# Altium project Dragonflyte.PrjPcb (part 1 of 2)
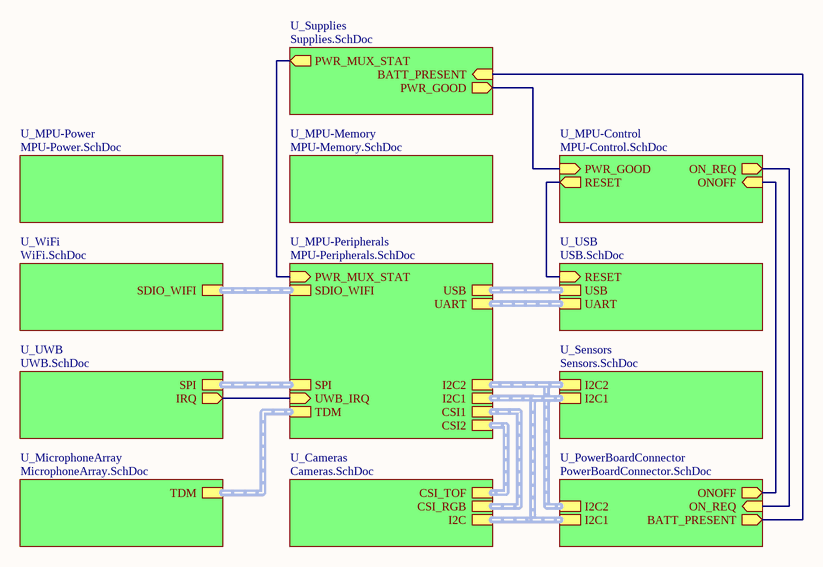
[diagram p0: Dragonflyte.SchDoc]
12 sheets, 197 parts. Net scope: hierarchical (ports join the sheet entries above them; power ports are global).
Board file: Dragonflyte.PcbDoc
Sheets:
  Dragonflyte.SchDoc
    U_Supplies = Supplies.SchDoc
    U_MPU-Power = MPU-Power.SchDoc
    U_MPU-Control = MPU-Control.SchDoc
    U_MPU-Peripherals = MPU-Peripherals.SchDoc
    U_WiFi = WiFi.SchDoc
    U_USB = USB.SchDoc
    U_Sensors = Sensors.SchDoc
    U_UWB = UWB.SchDoc
    U_MicrophoneArray = MicrophoneArray.SchDoc
    U_Cameras = Cameras.SchDoc
    U_PowerBoardConnector = PowerBoardConnector.SchDoc

## Sheet Dragonflyte.SchDoc
size A; DocumentNumber: 1; SheetNumber: 1

### Sub-sheets
U_Cameras = Cameras.SchDoc: CSI_TOF (harness CSI12), I2C (harness I2C), CSI_RGB (harness CSI8)
U_MicrophoneArray = MicrophoneArray.SchDoc: TDM (harness TDM)
U_MPU-Control = MPU-Control.SchDoc: PWR_GOOD (in), RESET (out), ON_REQ (out), ONOFF (in)
U_MPU-Memory = MPU-Memory.SchDoc (file not in this document): no entries
U_MPU-Peripherals = MPU-Peripherals.SchDoc: SDIO_WIFI (harness SDIO), UART (harness UART), USB (harness USB), TDM (harness TDM), SPI (harness SPI), CSI1 (harness CSI8), I2C2 (harness I2C), I2C1 (harness I2C), CSI2 (harness CSI12), UWB_IRQ (in), PWR_MUX_STAT (in)
U_MPU-Power = MPU-Power.SchDoc: no entries
U_PowerBoardConnector = PowerBoardConnector.SchDoc: ONOFF (out), ON_REQ (in), I2C1 (harness I2C), I2C2 (harness I2C), BATT_PRESENT (out)
U_Sensors = Sensors.SchDoc: I2C1 (harness I2C), I2C2 (harness I2C)
U_Supplies = Supplies.SchDoc: PWR_GOOD (out), PWR_MUX_STAT (out), BATT_PRESENT (in)
U_USB = USB.SchDoc: RESET (in), USB (harness USB), UART (harness UART)
U_UWB = UWB.SchDoc: SPI (harness SPI), IRQ (out)
U_WiFi = WiFi.SchDoc: SDIO_WIFI (harness SDIO)

### Nets
PWR_GOOD: sheet U_Supplies/PWR_GOOD, sheet U_MPU-Control/PWR_GOOD
RESET: sheet U_MPU-Control/RESET, sheet U_USB/RESET
NetJP3_5: sheet U_MPU-Control/ON_REQ, sheet U_PowerBoardConnector/ON_REQ
NetJP3_6: sheet U_MPU-Control/ONOFF, sheet U_PowerBoardConnector/ONOFF
NetJP3_32: sheet U_Supplies/BATT_PRESENT, sheet U_PowerBoardConnector/BATT_PRESENT
NetR38_1: sheet U_Supplies/PWR_MUX_STAT, sheet U_MPU-Peripherals/PWR_MUX_STAT
NetU1_A16: sheet U_MPU-Peripherals/UWB_IRQ, sheet U_UWB/IRQ

### Buses and harness runs
harness sheet U_Cameras/CSI_RGB = sheet U_MPU-Peripherals/CSI1
harness sheet U_Cameras/CSI_TOF = sheet U_MPU-Peripherals/CSI2
harness sheet U_Cameras/I2C = sheet U_MPU-Peripherals/I2C1 = sheet U_PowerBoardConnector/I2C1 = sheet U_Sensors/I2C1
harness sheet U_MicrophoneArray/TDM = sheet U_MPU-Peripherals/TDM
harness sheet U_MPU-Peripherals/I2C2 = sheet U_PowerBoardConnector/I2C2 = sheet U_Sensors/I2C2
harness sheet U_MPU-Peripherals/SDIO_WIFI = sheet U_WiFi/SDIO_WIFI
harness sheet U_MPU-Peripherals/SPI = sheet U_UWB/SPI
harness sheet U_MPU-Peripherals/UART = sheet U_USB/UART
harness sheet U_MPU-Peripherals/USB = sheet U_USB/USB

## Sheet Supplies.SchDoc
size A; DocumentNumber: 6; SheetNumber: 6
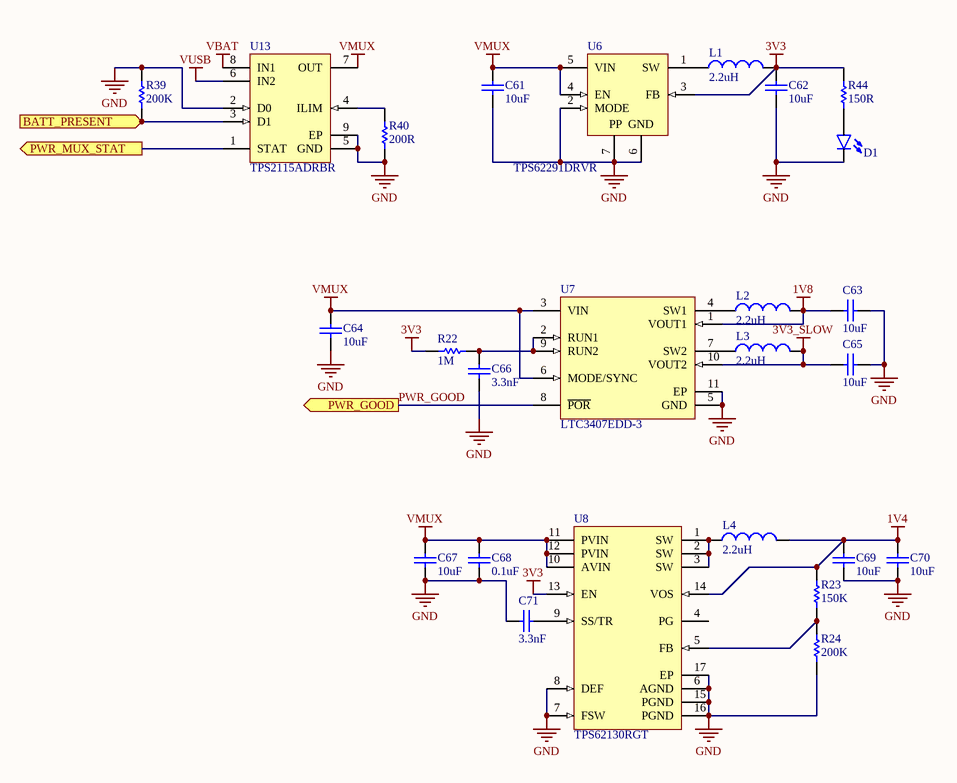
[diagram p1: Supplies.SchDoc]

### Parts
C61  value 10uF  [C0402[1005X55]]  (hidden comment: 10uF 6.3V 0402)
C62  value 10uF  [C0402[1005X55]]  (hidden comment: 10uF 6.3V 0402)
C63  value 10uF  [C0402[1005X55]]  (hidden comment: 10uF 6.3V 0402)
C64  value 10uF  [C0402[1005X55]]  (hidden comment: 10uF 6.3V 0402)
C65  value 10uF  [C0402[1005X55]]  (hidden comment: 10uF 6.3V 0402)
C66  value 3.3nF  [C0402[1005X55]]  (hidden comment: 3.3nF 50V 0402)
C67  value 10uF  [C0402[1005X55]]  (hidden comment: 10uF 6.3V 0402)
C68  value 0.1uF  [C0402[1005X55]]  (hidden comment: 0.1uF 6.3V 0402)
C69  value 10uF  [C0402[1005X55]]  (hidden comment: 10uF 6.3V 0402)
C70  value 10uF  [C0402[1005X55]]  (hidden comment: 10uF 6.3V 0402)
C71  value 3.3nF  [C0402[1005X55]]  (hidden comment: 3.3nF 50V 0402)
D1  LED_0603_BLUE_5mA  [LED0603]  (value not drawn)
L1  2.2uH  [IND0805]
L2  2.2uH  [IND0603]
L3  2.2uH  [IND0603]
L4  2.2uH  [IND1008]
R22  value 1M  [R0402[1005]]  (hidden comment: 1M 1% 0402)
R23  value 150K  [R0402[1005]]  (hidden comment: 150K 1% 0402)
R24  value 200K  [R0402[1005]]  (hidden comment: 200K 1% 0402)
R39  value 200K  [R0402[1005]]  (hidden comment: 200K 1% 0402)
R40  value 200R  [R0402[1005]]  (hidden comment: 200R 1% 0402)
R44  value 150R  [R0402[1005]]  (hidden comment: 150R 1% 0402)
U6  TPS62291DRVR  [WSON-6]
U7  LTC3407EDD-3  [VSON-10 (3mmx3mm)]
U8  TPS62130RGT  [QFN-16]
U13  TPS2115ADRBR  [VSON-8 (3x3MM)]

### Ports
BATT_PRESENT (in), PWR_GOOD (out), PWR_MUX_STAT (out)

### Nets
1V4: C69.2 C70.2 L4.2 R23.2 U8.14(VOS)
1V8: C63.2 L2.2 U7.1(VOUT1)
3V3: C62.2 L1.2 R22.2 R44.2 U6.3(FB) U8.13(EN)
3V3_SLOW: C65.1 L3.2 U7.10(VOUT2)
GND: C61.1 C62.1 C63.1 C64.1 C65.2 C66.1 C67.1 C68.1 C69.1 C70.1 C71.1 D1.C R24.1 R39.2 R40.1 U6.2(MODE) U6.6(GND) U6.7(EP) U7.5(GND) U7.11(EP) U8.6(AGND) U8.7(FSW) U8.8(DEF) U8.15(PGND) U8.16(PGND) U8.17(EP) U13.2(D0) U13.5(GND) U13.9(EP)
VBAT: U13.8(IN1)
VMUX: C61.2 C64.2 C67.2 C68.2 U6.4(EN) U6.5(VIN) U7.3(VIN) U7.6(MODE/SYNC) U8.10(AVIN) U8.11(PVIN) U8.12(PVIN) U13.7(OUT)
VUSB: U13.6(IN2)
PWR_GOOD: U7.8(~{POR}) ; port PWR_GOOD
NetC66_2: C66.2 R22.1 U7.2(RUN1) U7.9(RUN2)
NetC71_2: C71.2 U8.9(SS/TR)
NetD1_A: D1.A R44.1
NetJP3_32: R39.1 U13.3(D1) ; port BATT_PRESENT
NetL1_1: L1.1 U6.1(SW)
NetL2_1: L2.1 U7.4(SW1)
NetL3_1: L3.1 U7.7(SW2)
NetL4_1: L4.1 U8.1(SW) U8.2(SW) U8.3(SW)
NetR23_1: R23.1 R24.2 U8.5(FB)
NetR38_1: U13.1(STAT) ; port PWR_MUX_STAT
NetR40_2: R40.2 U13.4(ILIM)

Not connected (* = marked no-connect by the designer): U8 4(PG)

### Notes on the sheet
- (in symbol TPS62291DRVR) PP

### Library data of the parts
C61-C65 C67 C69 C70 = CAP_10uF_6.3V_0402_20%: 10uF 6.3V 20% 0402 (1005 Metric); PartNumber: GRM155R60J106ME44D; Manufacturer: Murata; Tolerance: 20%; Mounting Technology: Surface Mount; PackageReference: 0402; PackageDescription: 0402 (1005 Metric); Voltage: 6.3V
C66 C71 = CAP_3.3nF_50V_0402_10%: 3.3nF 50V 10% 0402 (1005 Metric); PartNumber: GRM155R71H332KA01D; Manufacturer: Murata; Mounting Technology: Surface Mount; PackageReference: 0402; PackageDescription: 0402 (1005 Metric); Voltage: 50V; Tolerance: 10%
C68 = CAP_0.1uF_6.3V_0402_10%: 0.1uF 6.3V 10% 0402 (1005 Metric); PartNumber: GRM155R70J104KA01D; Manufacturer: Murata; Mounting Technology: Surface Mount; PackageReference: 0402; PackageDescription: 0402 (1005 Metric); Voltage: 6.3V; Tolerance: 10%
D1 = LED_0603_BLUE_5mA: PartNumber: LTST-C193TBKT-5A; Manufacturer: Lite-On Inc.; PackageReference: 0603; PackageDescription: 0603 (1608 Metric); Mounting Technology: Surface Mount
L1 = IND_2.2uH_1.7A_0805_20%: 2.2uH 20% 1.7A 0805; PartNumber: LQM21PN2R2MGHL; Manufacturer: Murata; PackageReference: 0805; PackageDescription: 0805 (2012 metric); Value: 2.2uH; Mounting Technology: Surface Mount; Current: 1.7A
L2 L3 = IND_2.2uH_750mA_0603_20%: 2.2uH 20% 750mA 0603; PartNumber: LQM18PZ2R2MCHD; Manufacturer: Murata; PackageReference: 0603; PackageDescription: 0603 (1608 metric); Value: 2.2uH; Mounting Technology: Surface Mount; Current: 750mA
L4 = IND_2.2uH_3.3A_1008_20%: 2.2uH 20% 3.3A 1008; PartNumber: DFE252012F-2R2M=P2; Manufacturer: Murata; PackageReference: 1008; PackageDescription: 1008 (2520 metric); Mounting Technology: Surface Mount; Current: 3.3A; Value: 2.2uH
R22 = RES_1M_0402_1%: 1M 0.063W 1% 0402 (1005 Metric); Manufacturer: KOA Speer; PartNumber: RK73H1ETTP1004F; Tolerance: 1%; Power: 0.063W; Mounting Technology: Surface Mount; PackageReference: 0402; PackageDescription: 0402 (1005 Metric); ComponentLink1Description: Datasheet; ComponentLink1URL: http://www.koaspeer.com/catimages/Products/RK73H/RK73H.pdf
R23 = RES_150K_0402_1%: 150K 0.063W 1% 0402 (1005 Metric); Manufacturer: KOA Speer; PartNumber: RK73H1ETTP1503F; Tolerance: 1%; Power: 0.063W; Mounting Technology: Surface Mount; PackageReference: 0402; PackageDescription: 0402 (1005 Metric); ComponentLink1Description: Datasheet; ComponentLink1URL: http://www.koaspeer.com/catimages/Products/RK73H/RK73H.pdf
R24 R39 = RES_200K_0402_1%: 200K 0.063W 1% 0402 (1005 Metric); Manufacturer: KOA Speer; PartNumber: RK73H1ETTP2003F; Tolerance: 1%; Power: 0.063W; Mounting Technology: Surface Mount; PackageReference: 0402; PackageDescription: 0402 (1005 Metric); ComponentLink1Description: Datasheet; ComponentLink1URL: http://www.koaspeer.com/catimages/Products/RK73H/RK73H.pdf
R40 = RES_200R_0402_1%: 200R 0.063W 1% 0402 (1005 Metric); Manufacturer: KOA Speer; PartNumber: RK73H1ETTP2000F; Tolerance: 1%; Power: 0.063W; Mounting Technology: Surface Mount; PackageReference: 0402; PackageDescription: 0402 (1005 Metric); ComponentLink1Description: Datasheet; ComponentLink1URL: http://www.koaspeer.com/catimages/Products/RK73H/RK73H.pdf
R44 = RES_150R_0402_1%: 150R 0.063W 1% 0402 (1005 Metric); Manufacturer: KOA Speer; PartNumber: RK73H1ETTP1500F; Tolerance: 1%; Power: 0.063W; Mounting Technology: Surface Mount; PackageReference: 0402; PackageDescription: 0402 (1005 Metric); ComponentLink1Description: Datasheet; ComponentLink1URL: http://www.koaspeer.com/catimages/Products/RK73H/RK73H.pdf
U6 = TPS62291DRVR: Voltage Regulators - Switching Regulators 2.25MHz 1A Step-Down Cnvrtr 3.3V Output; Manufacturer: Texas Instruments; PartNumber: TPS62291DRVR; PackageReference: WSON-6; PackageDescription: SON, 6-Leads, Body 2x2mm, Pitch 0.65mm, Thermal Pad 1.6x1mm, TI Recommended; Mounting Technology: Surface Mount
U7 = LTC3407EDD-3: Manufacturer: Linear Technology; PartNumber: LTC3407EDD-3; PackageReference: SON-10; Mounting Technology: Surface Mount
U8 = TPS62130RGT: Manufacturer: Texas Instruments; PartNumber: TPS62130RGT; PackageReference: QFN-16; Mounting Technology: Surface Mount
U13 = TPS2115ADRBR: Power Switch ICs - Power Distribution Autoswitching Pwr Mux; Manufacturer: Texas Instruments; PartNumber: TPS2115ADRBR; PackageReference: VSON-8; Mounting Technology: Surface Mount

## Sheet MPU-Power.SchDoc
size B; DocumentNumber: 2; SheetNumber: 2
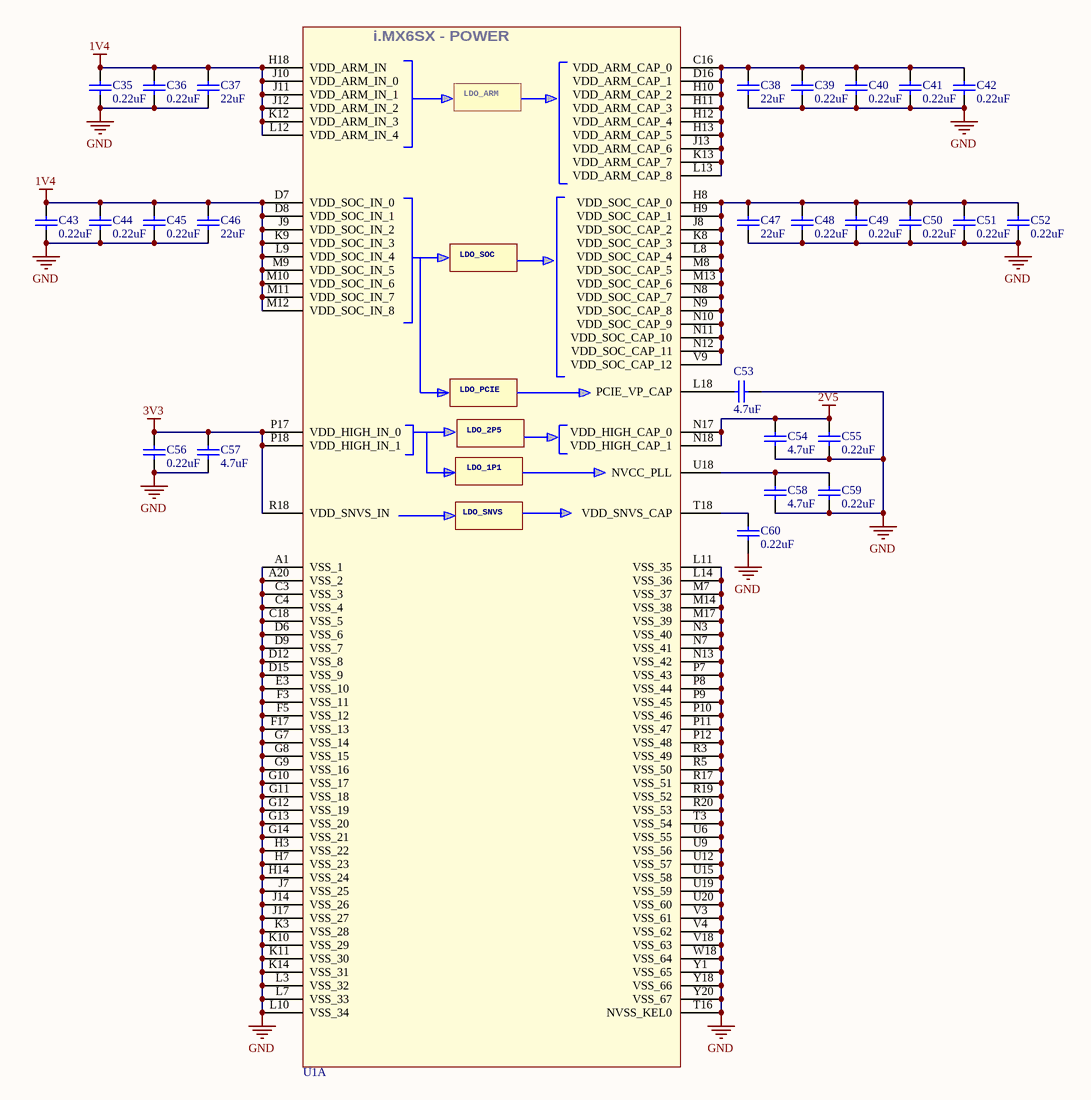
[diagram p2: MPU-Power.SchDoc]

### Parts
C35  value 0.22uF  [C0402[1005X55]]  (hidden comment: 0.22uF 6.3V 0402)
C36  value 0.22uF  [C0402[1005X55]]  (hidden comment: 0.22uF 6.3V 0402)
C37  value 22uF  [C0603[1608X92]]  (hidden comment: 22uF 6.3V 0603)
C38  value 22uF  [C0603[1608X92]]  (hidden comment: 22uF 6.3V 0603)
C39  value 0.22uF  [C0402[1005X55]]  (hidden comment: 0.22uF 6.3V 0402)
C40  value 0.22uF  [C0402[1005X55]]  (hidden comment: 0.22uF 6.3V 0402)
C41  value 0.22uF  [C0402[1005X55]]  (hidden comment: 0.22uF 6.3V 0402)
C42  value 0.22uF  [C0402[1005X55]]  (hidden comment: 0.22uF 6.3V 0402)
C43  value 0.22uF  [C0402[1005X55]]  (hidden comment: 0.22uF 6.3V 0402)
C44  value 0.22uF  [C0402[1005X55]]  (hidden comment: 0.22uF 6.3V 0402)
C45  value 0.22uF  [C0402[1005X55]]  (hidden comment: 0.22uF 6.3V 0402)
C46  value 22uF  [C0603[1608X92]]  (hidden comment: 22uF 6.3V 0603)
C47  value 22uF  [C0603[1608X92]]  (hidden comment: 22uF 6.3V 0603)
C48  value 0.22uF  [C0402[1005X55]]  (hidden comment: 0.22uF 6.3V 0402)
C49  value 0.22uF  [C0402[1005X55]]  (hidden comment: 0.22uF 6.3V 0402)
C50  value 0.22uF  [C0402[1005X55]]  (hidden comment: 0.22uF 6.3V 0402)
C51  value 0.22uF  [C0402[1005X55]]  (hidden comment: 0.22uF 6.3V 0402)
C52  value 0.22uF  [C0402[1005X55]]  (hidden comment: 0.22uF 6.3V 0402)
C53  value 4.7uF  [C0402[1005X55]]  (hidden comment: 4.7uF 6.3V 0402)
C54  value 4.7uF  [C0402[1005X55]]  (hidden comment: 4.7uF 6.3V 0402)
C55  value 0.22uF  [C0402[1005X55]]  (hidden comment: 0.22uF 6.3V 0402)
C56  value 0.22uF  [C0402[1005X55]]  (hidden comment: 0.22uF 6.3V 0402)
C57  value 4.7uF  [C0402[1005X55]]  (hidden comment: 4.7uF 6.3V 0402)
C58  value 4.7uF  [C0402[1005X55]]  (hidden comment: 4.7uF 6.3V 0402)
C59  value 0.22uF  [C0402[1005X55]]  (hidden comment: 0.22uF 6.3V 0402)
C60  value 0.22uF  [C0402[1005X55]]  (hidden comment: 0.22uF 6.3V 0402)
U1  MCIMX6X3EVO10AB  [BGA-400]  (value not drawn)  (part A of 12)

### Nets
1V4: C35.2 C36.2 C37.2 C43.2 C44.2 C45.2 C46.2 U1.D7(VDD_SOC_IN_0) U1.D8(VDD_SOC_IN_1) U1.H18(VDD_ARM_IN) U1.J9(VDD_SOC_IN_2) U1.J10(VDD_ARM_IN_0) U1.J11(VDD_ARM_IN_1) U1.J12(VDD_ARM_IN_2) U1.K9(VDD_SOC_IN_3) U1.K12(VDD_ARM_IN_3) U1.L9(VDD_SOC_IN_4) U1.L12(VDD_ARM_IN_4) U1.M9(VDD_SOC_IN_5) U1.M10(VDD_SOC_IN_6) U1.M11(VDD_SOC_IN_7) U1.M12(VDD_SOC_IN_8)
2V5: C54.2 C55.2 U1.N17(VDD_HIGH_CAP_0) U1.N18(VDD_HIGH_CAP_1)
3V3: C56.2 C57.2 U1.P17(VDD_HIGH_IN_0) U1.P18(VDD_HIGH_IN_1) U1.R18(VDD_SNVS_IN)
GND: C35.1 C36.1 C37.1 C38.1 C39.1 C40.1 C41.1 C42.1 C43.1 C44.1 C45.1 C46.1 C47.1 C48.1 C49.1 C50.1 C51.1 C52.1 C53.1 C54.1 C55.1 C56.1 C57.1 C58.1 C59.1 C60.1 U1.A1(VSS_1) U1.A20(VSS_2) U1.C3(VSS_3) U1.C4(VSS_4) U1.C18(VSS_5) U1.D6(VSS_6) U1.D9(VSS_7) U1.D12(VSS_8) U1.D15(VSS_9) U1.E3(VSS_10) U1.F3(VSS_11) U1.F5(VSS_12) U1.F17(VSS_13) U1.G7(VSS_14) U1.G8(VSS_15) U1.G9(VSS_16) U1.G10(VSS_17) U1.G11(VSS_18) U1.G12(VSS_19) U1.G13(VSS_20) U1.G14(VSS_21) U1.H3(VSS_22) U1.H7(VSS_23) U1.H14(VSS_24) U1.J7(VSS_25) U1.J14(VSS_26) U1.J17(VSS_27) U1.K3(VSS_28) U1.K10(VSS_29) U1.K11(VSS_30) U1.K14(VSS_31) U1.L3(VSS_32) U1.L7(VSS_33) U1.L10(VSS_34) U1.L11(VSS_35) U1.L14(VSS_36) U1.M7(VSS_37) U1.M14(VSS_38) U1.M17(VSS_39) U1.N3(VSS_40) U1.N7(VSS_41) U1.N13(VSS_42) U1.P7(VSS_43) U1.P8(VSS_44) U1.P9(VSS_45) U1.P10(VSS_46) U1.P11(VSS_47) U1.P12(VSS_48) U1.R3(VSS_49) U1.R5(VSS_50) U1.R17(VSS_51) U1.R19(VSS_52) U1.R20(VSS_53) U1.T3(VSS_54) U1.T16(NVSS_KEL0) U1.U6(VSS_55) U1.U9(VSS_56) U1.U12(VSS_57) U1.U15(VSS_58) U1.U19(VSS_59) U1.U20(VSS_60) U1.V3(VSS_61) U1.V4(VSS_62) U1.V18(VSS_63) U1.W18(VSS_64) U1.Y1(VSS_65) U1.Y18(VSS_66) U1.Y20(VSS_67)
NetC38_2: C38.2 C39.2 C40.2 C41.2 C42.2 U1.C16(VDD_ARM_CAP_0) U1.D16(VDD_ARM_CAP_1) U1.H10(VDD_ARM_CAP_2) U1.H11(VDD_ARM_CAP_3) U1.H12(VDD_ARM_CAP_4) U1.H13(VDD_ARM_CAP_5) U1.J13(VDD_ARM_CAP_6) U1.K13(VDD_ARM_CAP_7) U1.L13(VDD_ARM_CAP_8)
NetC47_2: C47.2 C48.2 C49.2 C50.2 C51.2 C52.2 U1.H8(VDD_SOC_CAP_0) U1.H9(VDD_SOC_CAP_1) U1.J8(VDD_SOC_CAP_2) U1.K8(VDD_SOC_CAP_3) U1.L8(VDD_SOC_CAP_4) U1.M8(VDD_SOC_CAP_5) U1.M13(VDD_SOC_CAP_6) U1.N8(VDD_SOC_CAP_7) U1.N9(VDD_SOC_CAP_8) U1.N10(VDD_SOC_CAP_9) U1.N11(VDD_SOC_CAP_10) U1.N12(VDD_SOC_CAP_11) U1.V9(VDD_SOC_CAP_12)
NetC53_2: C53.2 U1.L18(PCIE_VP_CAP)
NetC58_2: C58.2 C59.2 U1.U18(NVCC_PLL)
NetC60_2: C60.2 U1.T18(VDD_SNVS_CAP)

### Notes on the sheet
- (in symbol MCIMX6X3EVO10AB, part A) i.MX6SX - POWER; LDO_ARM; LDO_SOC; LDO_PCIE; LDO_2P5; LDO_1P1; LDO_SNVS

### Library data of the parts
C35 C36 C39-C45 C48-C52 C55 C56 C59 C60 = CAP_0.22uF_6.3V_0402_10%: 0.22uF 6.3V 10% 0402 (1005 Metric); PartNumber: JMK105BJ224KV-F; Manufacturer: Taiyo Yuden; Mounting Technology: Surface Mount; PackageReference: 0402; PackageDescription: 0402 (1005 Metric); Voltage: 6.3V; Tolerance: 10%
C37 C38 C46 C47 = CAP_22uF_6.3V_0603_10%: 22uF 6.3V 10% 0603 (1608 Metric); PartNumber: GRT188R60J226ME13D; Manufacturer: Murata; Mounting Technology: Surface Mount; PackageReference: 0603; PackageDescription: 0603 (1608 Metric); Voltage: 6.3V; Tolerance: 10%
C53 C54 C57 C58 = CAP_4.7uF_6.3V_0402_20%: 4.7uF 6.3V 20% 0402 (1005 Metric); PartNumber: GRM155R60J475ME47D; Manufacturer: Murata; Mounting Technology: Surface Mount; PackageReference: 0402; PackageDescription: 0402 (1005 Metric); Voltage: 6.3V; Tolerance: 20%
U1 = MCIMX6X3EVO10AB: IC MPU I.MX6SX 1GHZ 400MAPBGA; Manufacturer: NXP; PartNumber: MCIMX6X3EVO10AB; Mounting Technology: Surface Mount; PackageReference: BGA-400

## Sheet MPU-Control.SchDoc
size A
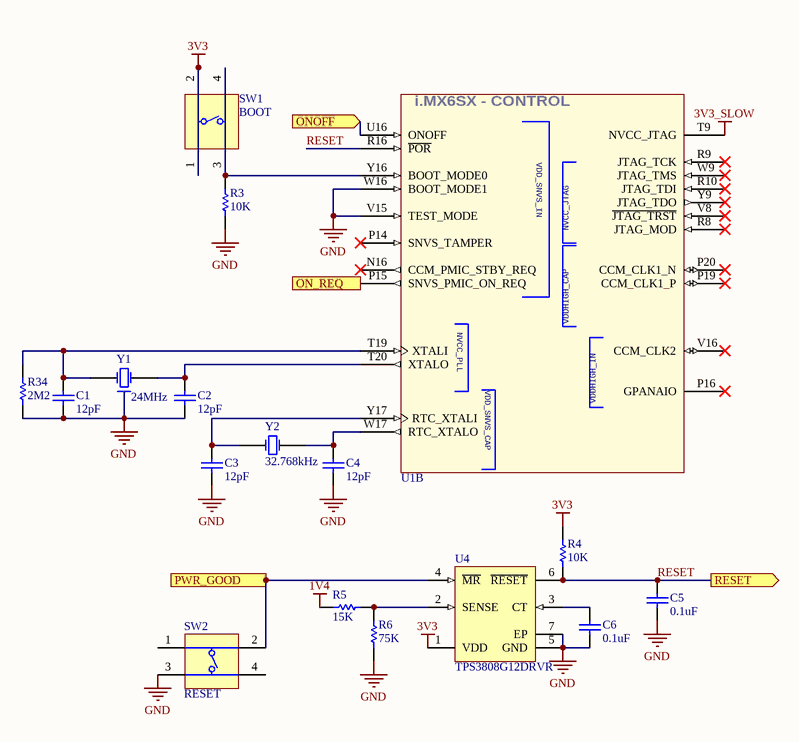
[diagram p3: MPU-Control.SchDoc]

### Parts
C1  value 12pF  [C0402[1005X55]]  (hidden comment: 12pF 50V 0402)
C2  value 12pF  [C0402[1005X55]]  (hidden comment: 12pF 50V 0402)
C3  value 12pF  [C0402[1005X55]]  (hidden comment: 12pF 50V 0402)
C4  value 12pF  [C0402[1005X55]]  (hidden comment: 12pF 50V 0402)
C5  value 0.1uF  [C0402[1005X55]]  (hidden comment: 0.1uF 6.3V 0402)
C6  value 0.1uF  [C0402[1005X55]]  (hidden comment: 0.1uF 100V 0402)
R3  value 10K  [R0402[1005]]  (hidden comment: 10K 1% 0402)
R4  value 10K  [R0402[1005]]  (hidden comment: 10K 1% 0402)
R5  value 15K  [R0402[1005]]  (hidden comment: 15K 1% 0402)
R6  value 75K  [R0402[1005]]  (hidden comment: 75K 1% 0402)
R34  value 2M2  [R0402[1005]]  (hidden comment: 2M2 1% 0402)
SW1  BOOT  [SWITCH]
SW2  RESET  [SWITCH]
U1  MCIMX6X3EVO10AB  [BGA-400]  (value not drawn)  (part B of 12)
U4  TPS3808G12DRVR  [WSON-6]
Y1  24MHz  [CRYSTAL_2.0x1.6]
Y2  32.768kHz  [CRYSTAL_2.0x1.2]

### Ports
ON_REQ (out), ONOFF (in), PWR_GOOD (in), RESET (out)

### Nets
1V4: R5.2
3V3: R4.2 SW1.1(T1) SW1.2(T2) U4.1(VDD)
3V3_SLOW: U1.T9(NVCC_JTAG)
GND: C1.1 C2.1 C3.1 C4.1 C5.1 C6.1 R3.1 R6.1 R34.1 SW2.3(T3) U1.V15(TEST_MODE) U1.W16(BOOT_MODE1) U4.5(GND) U4.7(EP) Y1.2
PWR_GOOD: SW2.2(T2) U4.4(~{MR}) ; port PWR_GOOD
RESET: C5.2 R4.1 U1.R16(~{POR}) U4.6(~{RESET}) ; port RESET
NetC1_2: C1.2 R34.2 U1.T19(XTALI) Y1.1(X1)
NetC2_2: C2.2 U1.T20(XTALO) Y1.3(X2)
NetC3_2: C3.2 U1.Y17(RTC_XTALI) Y2.1(X1)
NetC4_2: C4.2 U1.W17(RTC_XTALO) Y2.2(X2)
NetC6_2: C6.2 U4.3(CT)
NetJP3_5: U1.P15(SNVS_PMIC_ON_REQ) ; port ON_REQ
NetJP3_6: U1.U16(ONOFF) ; port ONOFF
NetR3_2: R3.2 SW1.3(T3) SW1.4(T3) U1.Y16(BOOT_MODE0)
NetR5_1: R5.1 R6.2 U4.2(SENSE)

Not connected (* = marked no-connect by the designer): SW2 1(T1) 4(T3); U1 N16(CCM_PMIC_STBY_REQ)* P14(SNVS_TAMPER)* P16(GPANAIO)* P19(CCM_CLK1_P)* P20(CCM_CLK1_N)* R8(JTAG_MOD)* R9(JTAG_TCK)* R10(JTAG_TDI)* V8(~{JTAG_TRST})* V16(CCM_CLK2)* W9(JTAG_TMS)* Y9(JTAG_TDO)*

### Notes on the sheet
- (in symbol MCIMX6X3EVO10AB, part B) i.MX6SX - CONTROL; VDDHIGH_CAP; VDDHIGH_IN
- (in symbol MCIMX6X3EVO10AB, part D) i.MX6SX - LCD1; NVCC_LCD1

### Library data of the parts
C1-C4 = CAP_12pF_50V_0402_5%: 12pF 50V 5% 0402 (1005 Metric); PartNumber: GRM1555C1H120JA01D; Manufacturer: Murata; Mounting Technology: Surface Mount; PackageReference: 0402; PackageDescription: 0402 (1005 Metric); Voltage: 50V; Tolerance: 5%
C5 = CAP_0.1uF_6.3V_0402_10%: as C68 on sheet Supplies; Mounting Technology: Surface Mount; PackageReference: 0402; PackageDescription: 0402 (1005 Metric); Voltage: 6.3V; Tolerance: 10%
C6 = CAP_0.1uF_100V_0402_10%: 0.1uF 100V 10% 0402 (1005 Metric); PartNumber: GRM155R62A104KE14D; Manufacturer: Murata; Mounting Technology: Surface Mount; PackageReference: 0402; PackageDescription: 0402 (1005 Metric); Voltage: 100V; Tolerance: 10%
R3 R4 = RES_10K_0402_1%: 10K 0.063W 1% 0402 (1005 Metric); Manufacturer: KOA Speer; PartNumber: RK73H1ETTP1002F; Tolerance: 1%; Power: 0.063W; Mounting Technology: Surface Mount; PackageReference: 0402; PackageDescription: 0402 (1005 Metric); ComponentLink1Description: Datasheet; ComponentLink1URL: http://www.koaspeer.com/catimages/Products/RK73H/RK73H.pdf
R5 = RES_15K_0402_1%: 15K 0.063W 1% 0402 (1005 Metric); Manufacturer: KOA Speer; PartNumber: RK73H1ETTP1502F; Tolerance: 1%; Power: 0.063W; Mounting Technology: Surface Mount; PackageReference: 0402; PackageDescription: 0402 (1005 Metric); ComponentLink1Description: Datasheet; ComponentLink1URL: http://www.koaspeer.com/catimages/Products/RK73H/RK73H.pdf
R6 = RES_75K_0402_1%: 75K 0.063W 1% 0402 (1005 Metric); Manufacturer: KOA Speer; PartNumber: RK73H1ETTP7502F; Tolerance: 1%; Power: 0.063W; Mounting Technology: Surface Mount; PackageReference: 0402; PackageDescription: 0402 (1005 Metric); ComponentLink1Description: Datasheet; ComponentLink1URL: http://www.koaspeer.com/catimages/Products/RK73H/RK73H.pdf
R34 = RES_2M2_0402_1%: 2M2 0.063W 1% 0402 (1005 Metric); Manufacturer: KOA Speer; PartNumber: RK73H1ETTP2204F; Tolerance: 1%; Power: 0.063W; Mounting Technology: Surface Mount; PackageReference: 0402; PackageDescription: 0402 (1005 Metric); ComponentLink1Description: Datasheet; ComponentLink1URL: http://www.koaspeer.com/catimages/Products/RK73H/RK73H.pdf
SW1 SW2 = DIPT-DTSM-6: Switch, SPNO Push Button SMD; Manufacturer: C&K Components; PartNumber: PTS810 SJM 250 SMTR LFS; Packing Type: Tape&Reel; Mechanical Life: 200,000 cycles; ComponentLink2URL: http://www.dip.com.tw/Products_tact.htm; ComponentLink1URL: http://www.dip.com.tw/; ComponentLink3URL: http://www.dip.com.tw/PDF/pro_tact/DTSM_G_-6_2_-V.pdf; PackageDescription: Switch, Surface Mount, 4 Leads, Body 4.6x2.8mm, Height 1.9mm; ComponentLink2Description: Datasheet; ComponentLink3Description: Package Specification; ComponentLink1Description: Manufacturer URL; PackageReference: PTS810; Mounting Technology: Surface Mount
U1 = MCIMX6X3EVO10AB: as U1 on sheet MPU-Power; PartNumber: MCIMX6X3EVO10AB; Mounting Technology: Surface Mount; PackageReference: BGA-400
U4 = TPS3808G12DRVR: Manufacturer: Texas Instruments; PackageReference: WSON-6; Mounting Technology: Surface Mount; PartNumber: TPS3808G12DRVR
Y1 = FA-128 24.0000MF10Z-W3: Manufacturer: EPSON; PartNumber: FA-128 24.0000MF10Z-W3; Mounting Technology: Surface Mount; PackageReference: 4-SMD
Y2 = ABS06-32.768KHZ-9-1-T: Manufacturer: Abracon; PartNumber: ABS06-32.768KHZ-9-1-T; Mounting Technology: Surface Mount; PackageReference: 4-SMD

## Sheet MPU-Peripherals.SchDoc
size C
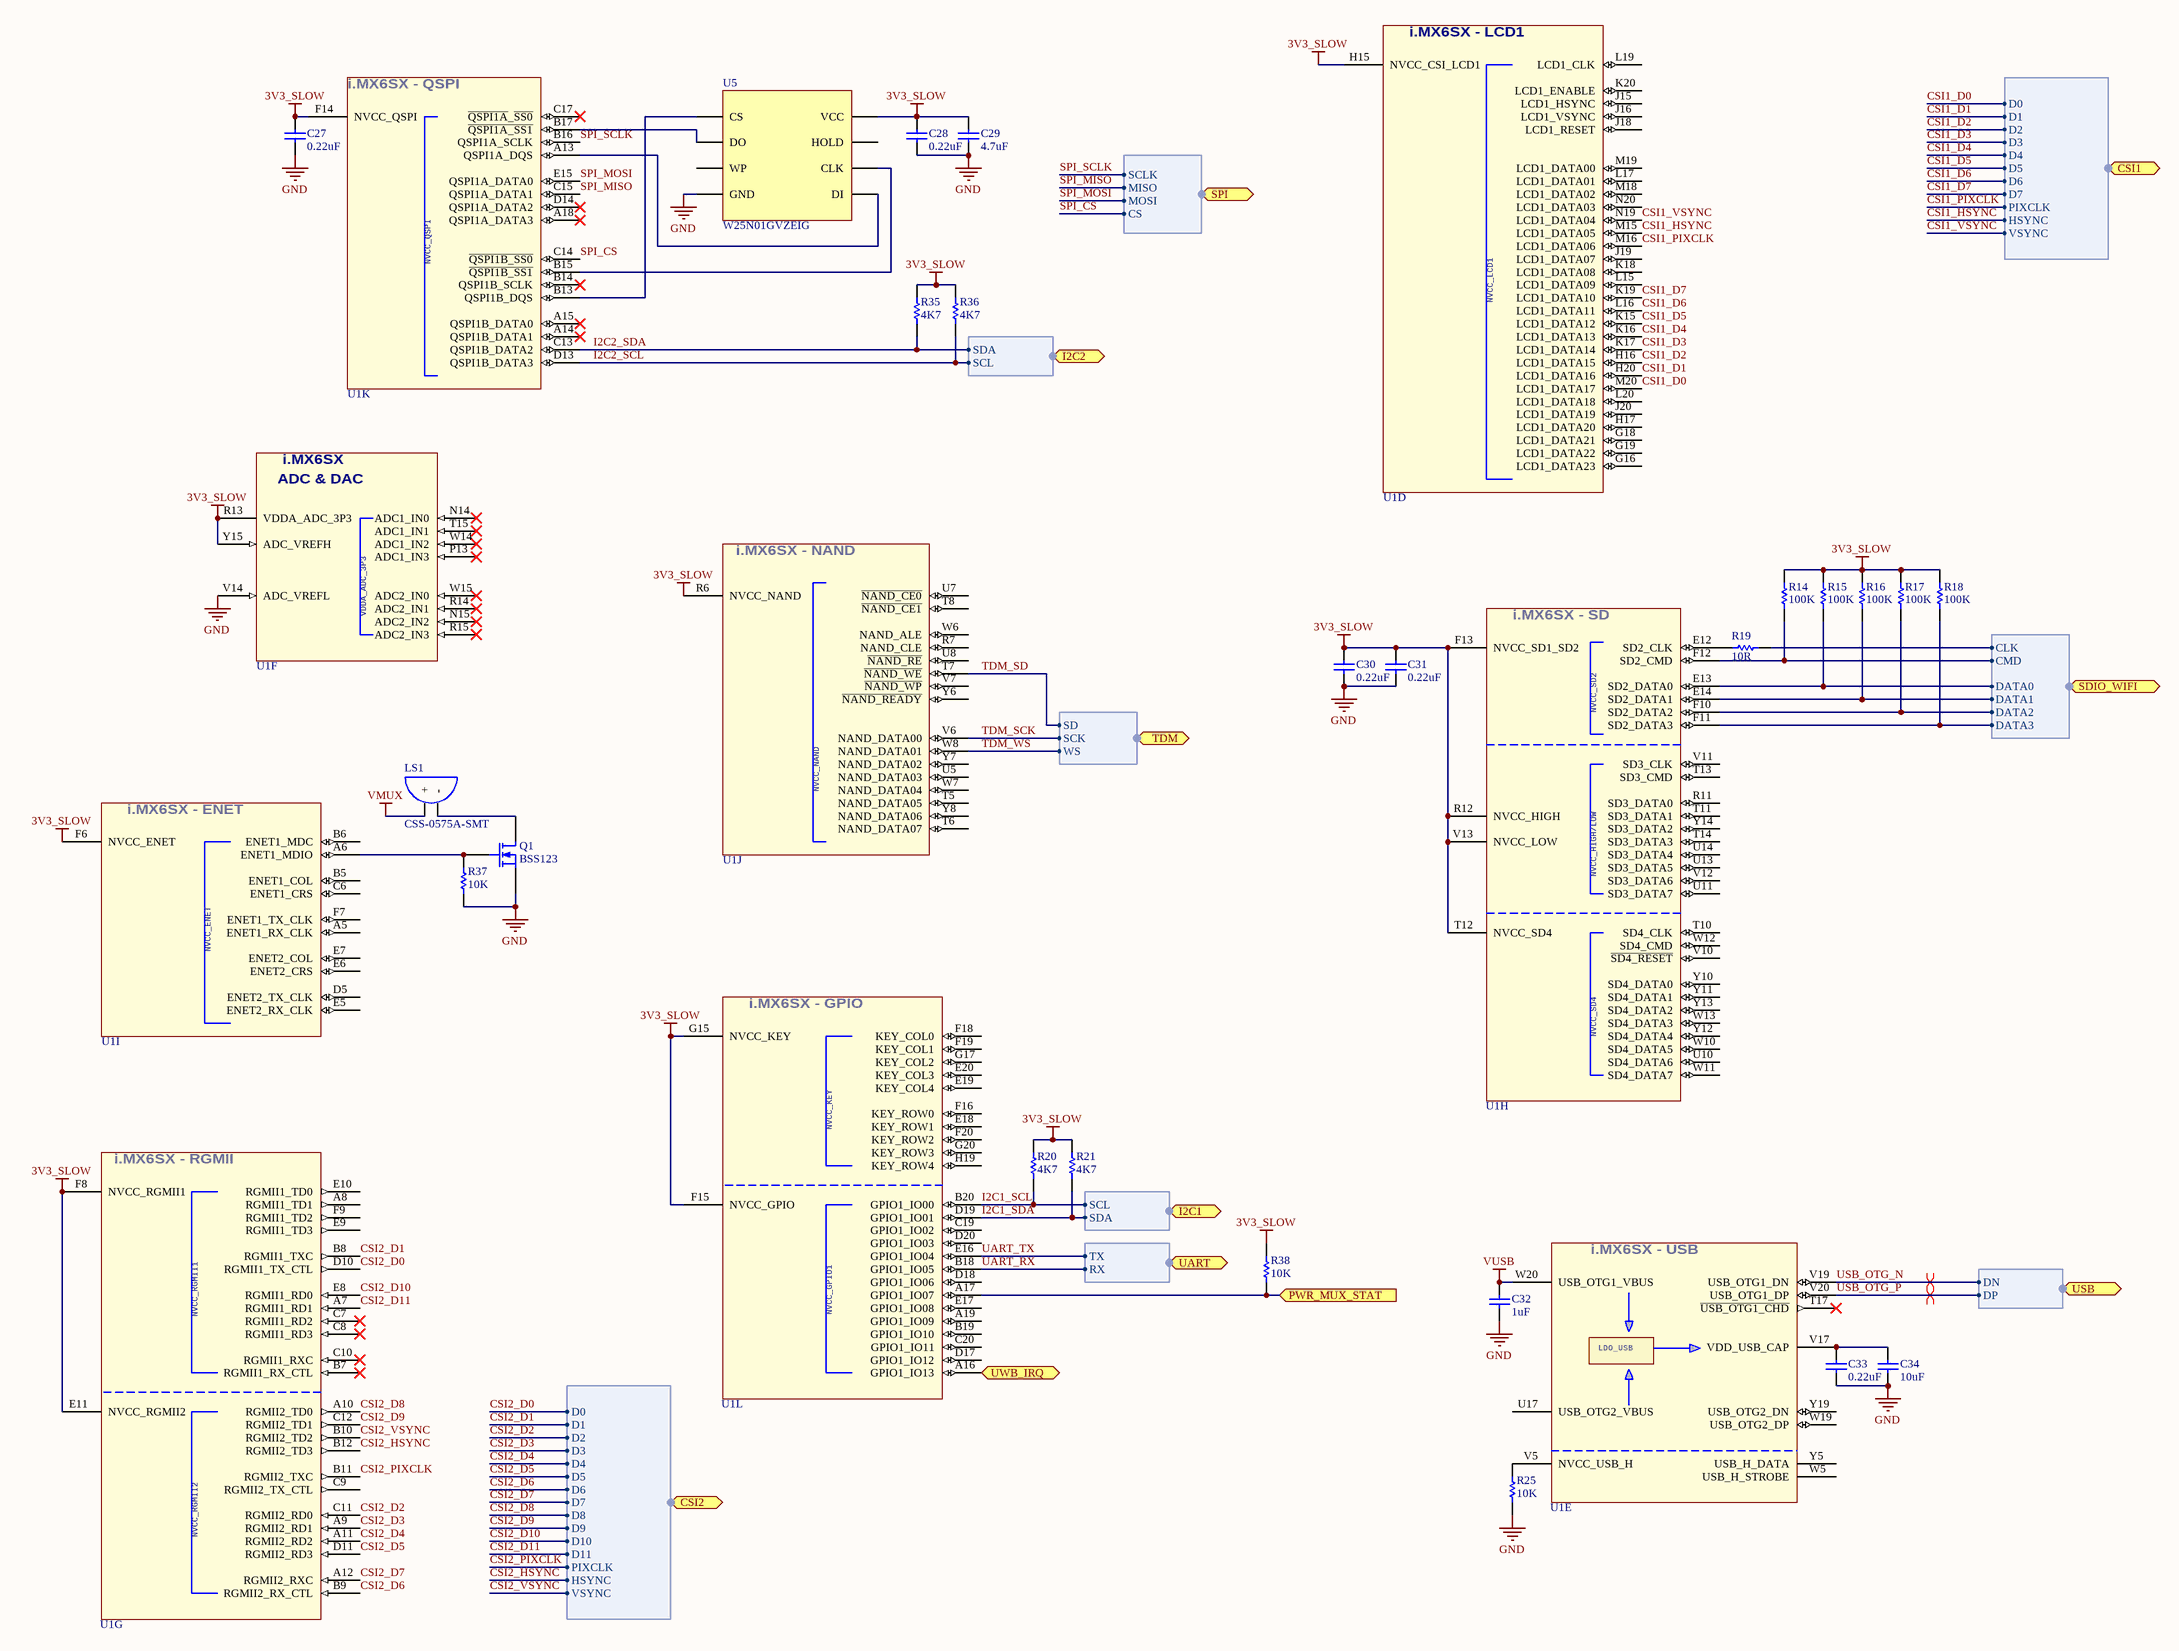
[diagram p4: MPU-Peripherals.SchDoc]

### Parts
C27  value 0.22uF  [C0402[1005X55]]  (hidden comment: 0.22uF 6.3V 0402)
C28  value 0.22uF  [C0402[1005X55]]  (hidden comment: 0.22uF 6.3V 0402)
C29  value 4.7uF  [C0402[1005X55]]  (hidden comment: 4.7uF 6.3V 0402)
C30  value 0.22uF  [C0402[1005X55]]  (hidden comment: 0.22uF 6.3V 0402)
C31  value 0.22uF  [C0402[1005X55]]  (hidden comment: 0.22uF 6.3V 0402)
C32  value 1uF  [C0402[1005X55]]  (hidden comment: 1uF 16V 0402)
C33  value 0.22uF  [C0402[1005X55]]  (hidden comment: 0.22uF 6.3V 0402)
C34  value 10uF  [C0402[1005X55]]  (hidden comment: 10uF 6.3V 0402)
LS1  CSS-0575A-SMT  [CSS-0575A-SMT]
Q1  BSS123  [SOT323-3]
R14  value 100K  [R0402[1005]]  (hidden comment: 100K 1% 0402)
R15  value 100K  [R0402[1005]]  (hidden comment: 100K 1% 0402)
R16  value 100K  [R0402[1005]]  (hidden comment: 100K 1% 0402)
R17  value 100K  [R0402[1005]]  (hidden comment: 100K 1% 0402)
R18  value 100K  [R0402[1005]]  (hidden comment: 100K 1% 0402)
R19  value 10R  [R0402[1005]]  (hidden comment: 10R 1% 0402)
R20  value 4K7  [R0402[1005]]  (hidden comment: 4K7 1% 0402)
R21  value 4K7  [R0402[1005]]  (hidden comment: 4K7 1% 0402)
R25  value 10K  [R0402[1005]]  (hidden comment: 10K 1% 0402)
R35  value 4K7  [R0402[1005]]  (hidden comment: 4K7 1% 0402)
R36  value 4K7  [R0402[1005]]  (hidden comment: 4K7 1% 0402)
R37  value 10K  [R0402[1005]]  (hidden comment: 10K 1% 0402)
R38  value 10K  [R0402[1005]]  (hidden comment: 10K 1% 0402)
U1  MCIMX6X3EVO10AB  [BGA-400]  (value not drawn)  (parts D,E,F,G,H,I,J,K,L of 12)
U5  W25N01GVZEIG  [WSON-8 (6X8MM)]

### Ports
CSI1 (harness CSI8), CSI2 (harness CSI12), I2C1 (harness I2C), I2C2 (harness I2C), PWR_MUX_STAT (in), SDIO_WIFI (harness SDIO), SPI (harness SPI), TDM (harness TDM), UART (harness UART), USB (harness USB), UWB_IRQ (in)

### Harnesses
SDIO: CLK, CMD, DATA0, DATA1, DATA2, DATA3
CSI12: D2, D3, D1, D0, D6, D7, D5, D4, D10, D9, D8, PIXCLK, D11, HSYNC, VSYNC
I2C: SCL, SDA
UART: TX, RX
USB: DN, DP
CSI8: D2, D3, D1, D0, D6, D7, D5, D4, PIXCLK, HSYNC, VSYNC
SPI: SCLK, MISO, MOSI, CS
TDM: WS, SCK, SD

### Nets
3V3_SLOW: C27.2 C28.2 C29.2 C30.2 C31.2 R14.2 R15.2 R16.2 R17.2 R18.2 R20.2 R21.2 R35.2 R36.2 R38.2 U1.E11(NVCC_RGMII2) U1.F6(NVCC_ENET) U1.F8(NVCC_RGMII1) U1.F13(NVCC_SD1_SD2) U1.F14(NVCC_QSPI) U1.F15(NVCC_GPIO) U1.G15(NVCC_KEY) U1.H15(NVCC_CSI_LCD1) U1.R6(NVCC_NAND) U1.R12(NVCC_HIGH) U1.R13(VDDA_ADC_3P3) U1.T12(NVCC_SD4) U1.V13(NVCC_LOW) U1.Y15(ADC_VREFH) U5.8(VCC)
GND: C27.1 C28.1 C29.1 C30.1 C31.1 C32.1 C33.1 C34.1 Q1.2(S) R25.1 R37.1 U1.V14(ADC_VREFL) U5.4(GND)
VMUX: LS1.1(+)
VUSB: C32.2 U1.W20(USB_OTG1_VBUS)
CSI1_D0: U1.M20(LCD1_DATA17) ; port CSI1.D0
CSI1_D1: U1.H20(LCD1_DATA16) ; port CSI1.D1
CSI1_D2: U1.H16(LCD1_DATA15) ; port CSI1.D2
CSI1_D3: U1.K17(LCD1_DATA14) ; port CSI1.D3
CSI1_D4: U1.K16(LCD1_DATA13) ; port CSI1.D4
CSI1_D5: U1.K15(LCD1_DATA12) ; port CSI1.D5
CSI1_D6: U1.L16(LCD1_DATA11) ; port CSI1.D6
CSI1_D7: U1.K19(LCD1_DATA10) ; port CSI1.D7
CSI1_HSYNC: U1.M15(LCD1_DATA05) ; port CSI1.HSYNC
CSI1_PIXCLK: U1.M16(LCD1_DATA06) ; port CSI1.PIXCLK
CSI1_VSYNC: U1.N19(LCD1_DATA04) ; port CSI1.VSYNC
CSI2_D0: U1.D10(RGMII1_TX_CTL) ; port CSI2.D0
CSI2_D1: U1.B8(RGMII1_TXC) ; port CSI2.D1
CSI2_D2: U1.C11(RGMII2_RD0) ; port CSI2.D2
CSI2_D3: U1.A9(RGMII2_RD1) ; port CSI2.D3
CSI2_D4: U1.A11(RGMII2_RD2) ; port CSI2.D4
CSI2_D5: U1.D11(RGMII2_RD3) ; port CSI2.D5
CSI2_D6: U1.B9(RGMII2_RX_CTL) ; port CSI2.D6
CSI2_D7: U1.A12(RGMII2_RXC) ; port CSI2.D7
CSI2_D8: U1.A10(RGMII2_TD0) ; port CSI2.D8
CSI2_D9: U1.C12(RGMII2_TD1) ; port CSI2.D9
CSI2_D10: U1.E8(RGMII1_RD0) ; port CSI2.D10
CSI2_D11: U1.A7(RGMII1_RD1) ; port CSI2.D11
CSI2_HSYNC: U1.B12(RGMII2_TD3) ; port CSI2.HSYNC
CSI2_PIXCLK: U1.B11(RGMII2_TXC) ; port CSI2.PIXCLK
CSI2_VSYNC: U1.B10(RGMII2_TD2) ; port CSI2.VSYNC
I2C1_SCL: R20.1 U1.B20(GPIO1_IO00) ; port I2C1.SCL
I2C1_SDA: R21.1 U1.D19(GPIO1_IO01) ; port I2C1.SDA
I2C2_SCL: R36.1 U1.D13(QSPI1B_DATA3) ; port I2C2.SCL
I2C2_SDA: R35.1 U1.C13(QSPI1B_DATA2) ; port I2C2.SDA
SPI_CS: U1.C14(~{QSPI1B_SS0}) ; port SPI.CS
SPI_MISO: U1.C15(QSPI1A_DATA1) ; port SPI.MISO
SPI_MOSI: U1.E15(QSPI1A_DATA0) ; port SPI.MOSI
SPI_SCLK: U1.B16(QSPI1A_SCLK) ; port SPI.SCLK
TDM_SCK: U1.V6(NAND_DATA00) ; port TDM.SCK
TDM_SD: U1.T7(~{NAND_WE}) ; port TDM.SD
TDM_WS: U1.W8(NAND_DATA01) ; port TDM.WS
UART_RX: U1.B18(GPIO1_IO05) ; port UART.RX
UART_TX: U1.E16(GPIO1_IO04) ; port UART.TX
USB_OTG_N: U1.V19(USB_OTG1_DN) ; port USB.DN
USB_OTG_P: U1.V20(USB_OTG1_DP) ; port USB.DP
NetC33_2: C33.2 C34.2 U1.V17(VDD_USB_CAP)
NetLS1_2: LS1.2(-) Q1.3(D)
NetQ1_1: Q1.1(G) R37.2 U1.A6(ENET1_MDIO)
NetR14_1: R14.1 U1.F12(SD2_CMD) ; port SDIO_WIFI.CMD
NetR15_1: R15.1 U1.E13(SD2_DATA0) ; port SDIO_WIFI.DATA0
NetR16_1: R16.1 U1.E14(SD2_DATA1) ; port SDIO_WIFI.DATA1
NetR17_1: R17.1 U1.F10(SD2_DATA2) ; port SDIO_WIFI.DATA2
NetR18_1: R18.1 U1.F11(SD2_DATA3) ; port SDIO_WIFI.DATA3
NetR19_1: R19.1 U1.E12(SD2_CLK)
NetR19_2: R19.2 ; port SDIO_WIFI.CLK
NetR25_2: R25.2 U1.V5(NVCC_USB_H)
NetR38_1: R38.1 U1.A17(GPIO1_IO07) ; port PWR_MUX_STAT
NetU1_A13: U1.A13(QSPI1A_DQS) U5.5(DI)
NetU1_A16: U1.A16(GPIO1_IO13) ; port UWB_IRQ
NetU1_B13: U1.B13(QSPI1B_DQS) U5.1(CS)
NetU1_B15: U1.B15(~{QSPI1B_SS1}) U5.6(CLK)
NetU1_B17: U1.B17(~{QSPI1A_SS1}) U5.2(DO)

Not connected (* = marked no-connect by the designer): U1 A5(ENET1_RX_CLK) A8(RGMII1_TD1) A14(QSPI1B_DATA1)* A15(QSPI1B_DATA0)* A18(QSPI1A_DATA3)* A19(GPIO1_IO09) B5(ENET1_COL) B6(ENET1_MDC) B7(RGMII1_RX_CTL)* B14(QSPI1B_SCLK)* B19(GPIO1_IO10) C6(ENET1_CRS) C7(RGMII1_RD2)* C8(RGMII1_RD3)* C9(RGMII2_TX_CTL) C10(RGMII1_RXC)* C17(~{QSPI1A}_~{SS0})* C19(GPIO1_IO02) C20(GPIO1_IO11) D5(ENET2_TX_CLK) D14(QSPI1A_DATA2)* D17(GPIO1_IO12) D18(GPIO1_IO06) D20(GPIO1_IO03) E5(ENET2_RX_CLK) E6(ENET2_CRS) E7(ENET2_COL) E9(RGMII1_TD3) E10(RGMII1_TD0) E17(GPIO1_IO08) E18(KEY_ROW1) E19(KEY_COL4) E20(KEY_COL3) F7(ENET1_TX_CLK) F9(RGMII1_TD2) F16(KEY_ROW0) F18(KEY_COL0) F19(KEY_COL1) F20(KEY_ROW2) G16(LCD1_DATA23) G17(KEY_COL2) G18(LCD1_DATA21) G19(LCD1_DATA22) G20(KEY_ROW3) H17(LCD1_DATA20) H19(KEY_ROW4) J15(LCD1_HSYNC) J16(LCD1_VSYNC) J18(LCD1_RESET) J19(LCD1_DATA07) J20(LCD1_DATA19) K18(LCD1_DATA08) K20(LCD1_ENABLE) L15(LCD1_DATA09) L17(LCD1_DATA01) L19(LCD1_CLK) L20(LCD1_DATA18) M18(LCD1_DATA02) M19(LCD1_DATA00) N14(ADC1_IN0)* N15(ADC2_IN2)* N20(LCD1_DATA03) P13(ADC1_IN3)* R7(NAND_CLE) R11(SD3_DATA0) R14(ADC2_IN1)* R15(ADC2_IN3)* T5(NAND_DATA05) T6(NAND_DATA07) T8(~{NAND_CE1}) T10(SD4_CLK) T11(SD3_DATA1) T13(SD3_CMD) T14(SD3_DATA3) T15(ADC1_IN1)* T17(~{USB_OTG1_CHD})* U5(NAND_DATA03) U7(~{NAND_CE0}) U8(~{NAND_RE}) U10(SD4_DATA6) U11(SD3_DATA7) U13(SD3_DATA5) U14(SD3_DATA4) U17(USB_OTG2_VBUS) V7(~{NAND_WP}) V10(~{SD4_RESET}) V11(SD3_CLK) V12(SD3_DATA6) W5(USB_H_STROBE) W6(NAND_ALE) W7(NAND_DATA04) W10(SD4_DATA5) W11(SD4_DATA7) W12(SD4_CMD) W13(SD4_DATA3) W14(ADC1_IN2)* W15(ADC2_IN0)* W19(USB_OTG2_DP) Y5(USB_H_DATA) Y6(~{NAND_READY}) Y7(NAND_DATA02) Y8(NAND_DATA06) Y10(SD4_DATA0) Y11(SD4_DATA1) Y12(SD4_DATA4) Y13(SD4_DATA2) Y14(SD3_DATA2) Y19(USB_OTG2_DN); U5 3(WP) 7(HOLD)

### Layout directives
differential pair: USB_OTG_N, USB_OTG_P

### Notes on the sheet
- (in symbol MCIMX6X3EVO10AB, part D) i.MX6SX - LCD1; NVCC_LCD1
- (in symbol MCIMX6X3EVO10AB, part E) i.MX6SX - USB; LDO_USB
- (in symbol MCIMX6X3EVO10AB, part F) i.MX6SX; ADC & DAC
- (in symbol MCIMX6X3EVO10AB, part G) i.MX6SX - RGMII
- (in symbol MCIMX6X3EVO10AB, part H) i.MX6SX - SD; NVCC_SD2; NVCC_HIGH/LOW
- (in symbol MCIMX6X3EVO10AB, part I) i.MX6SX - ENET
- (in symbol MCIMX6X3EVO10AB, part J) i.MX6SX - NAND
- (in symbol MCIMX6X3EVO10AB, part K) i.MX6SX - QSPI
- (in symbol MCIMX6X3EVO10AB, part L) i.MX6SX - GPIO; NVCC_GPIO1

### Library data of the parts
C27 C28 C30 C31 C33 = CAP_0.22uF_6.3V_0402_10%: as C35 on sheet MPU-Power; Mounting Technology: Surface Mount; PackageReference: 0402; PackageDescription: 0402 (1005 Metric); Voltage: 6.3V; Tolerance: 10%
C29 = CAP_4.7uF_6.3V_0402_20%: as C53 on sheet MPU-Power; Mounting Technology: Surface Mount; PackageReference: 0402; PackageDescription: 0402 (1005 Metric); Voltage: 6.3V; Tolerance: 20%
C32 = CAP_1uF_16V_0402_10%: 1uF 16V 10% 0402 (1005 Metric); PartNumber: GRM155R61C105KE01D; Manufacturer: Murata; Mounting Technology: Surface Mount; PackageReference: 0402; PackageDescription: 0402 (1005 Metric); Voltage: 16V; Tolerance: 10%
C34 = CAP_10uF_6.3V_0402_20%: as C61 on sheet Supplies; Mounting Technology: Surface Mount; PackageReference: 0402; PackageDescription: 0402 (1005 Metric); Voltage: 6.3V; Tolerance: 20%
LS1 = CSS-0575A-SMT: Magnetic Buzzer Transducer; Manufacturer: CUI, Inc.; PartNumber: CSS-0575A-SMT; Mounting Technology: Surface Mount; PackageReference: 5x5x1.9mm
Q1 = BSS123WQ-7-F: N-Channel MOSFET; Manufacturer: Diodes Incorporated; PackageReference: SOT-323-3; PartNumber: BSS123WQ-7-F; Mounting Technology: Surface Mount
R14-R18 = RES_100K_0402_1%: 100K 0.063W 1% 0402 (1005 Metric); Manufacturer: KOA Speer; PartNumber: RK73H1ETTP1003F; Tolerance: 1%; Power: 0.063W; Mounting Technology: Surface Mount; PackageReference: 0402; PackageDescription: 0402 (1005 Metric); ComponentLink1Description: Datasheet; ComponentLink1URL: http://www.koaspeer.com/catimages/Products/RK73H/RK73H.pdf
R19 = RES_10R_0402_1%: 10R 0.063W 1% 0402 (1005 Metric); Manufacturer: KOA Speer; PartNumber: RK73H1ETTP10R0F; Tolerance: 1%; Power: 0.063W; Mounting Technology: Surface Mount; PackageReference: 0402; PackageDescription: 0402 (1005 Metric); ComponentLink1Description: Datasheet; ComponentLink1URL: http://www.koaspeer.com/catimages/Products/RK73H/RK73H.pdf
R20 R21 R35 R36 = RES_4K7_0402_1%: 4K7 0.063W 1% 0402 (1005 Metric); Manufacturer: KOA Speer; PartNumber: RK73H1ETTP4701F; Tolerance: 1%; Power: 0.063W; Mounting Technology: Surface Mount; PackageReference: 0402; PackageDescription: 0402 (1005 Metric); ComponentLink1Description: Datasheet; ComponentLink1URL: http://www.koaspeer.com/catimages/Products/RK73H/RK73H.pdf
R25 R37 R38 = RES_10K_0402_1%: as R3 on sheet MPU-Control; Tolerance: 1%; Power: 0.063W; Mounting Technology: Surface Mount; PackageReference: 0402; PackageDescription: 0402 (1005 Metric); ComponentLink1Description: Datasheet; ComponentLink1URL: http://www.koaspeer.com/catimages/Products/RK73H/RK73H.pdf
U1 = MCIMX6X3EVO10AB: as U1 on sheet MPU-Power; PartNumber: MCIMX6X3EVO10AB; Mounting Technology: Surface Mount; PackageReference: BGA-400
U5 = W25N01GVZEIG: pin to pad: 4>4+9; Manufacturer: Winbond Electronics; PartNumber: W25N01GVZEIG; Mounting Technology: Surface Mount; PackageReference: WSON-8

## Sheet WiFi.SchDoc
size A; DocumentNumber: 7; SheetNumber: 7
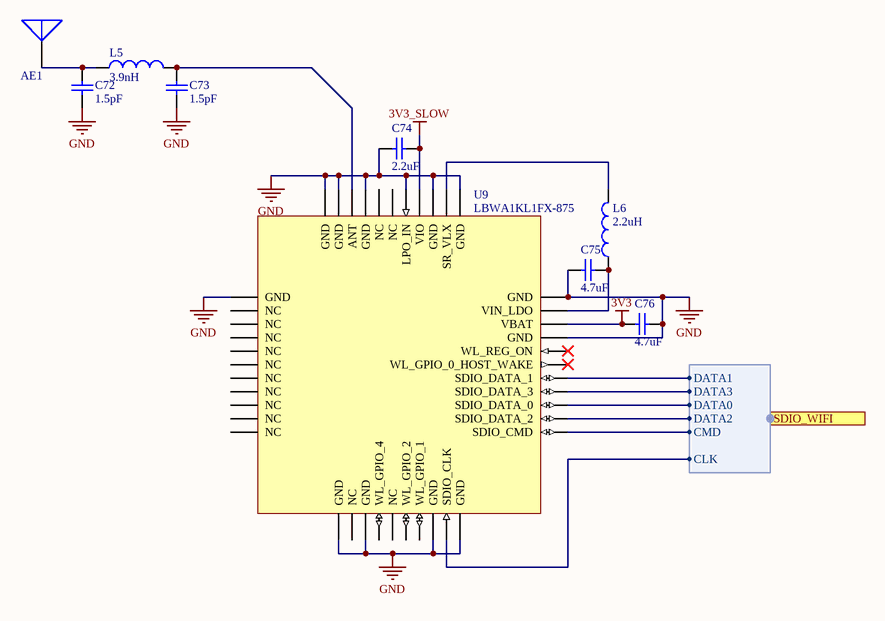
[diagram p5: WiFi.SchDoc]

### Parts
AE1  2450AT42A100E  [ANTENNA (3.2x1.6MM)]  (value not drawn)
C72  value 1.5pF  [C0402[1005X55]]  (hidden comment: 1.5pF 50V 0402)
C73  value 1.5pF  [C0402[1005X55]]  (hidden comment: 1.5pF 50V 0402)
C74  value 2.2uF  [C0402[1005X55]]  (hidden comment: 2.2uF 6.3V 0402)
C75  value 4.7uF  [C0402[1005X55]]  (hidden comment: 4.7uF 6.3V 0402)
C76  value 4.7uF  [C0402[1005X55]]  (hidden comment: 4.7uF 6.3V 0402)
L5  3.9nH  [IND0402]
L6  2.2uH  [IND0603]
U9  LBWA1KL1FX-875  [LGA-42]

### Ports
SDIO_WIFI (harness SDIO)

### Harnesses
SDIO: CLK, CMD, DATA0, DATA1, DATA2, DATA3

### Nets
3V3: C76.2 U9.30(VBAT)
3V3_SLOW: C74.1 U9.36(VIO)
GND: C72.1 C73.1 C74.2 C75.2 C76.1 U9.1(GND) U9.12(GND) U9.14(GND) U9.19(GND) U9.21(GND) U9.29(GND) U9.32(GND) U9.33(GND) U9.35(GND) U9.37(LPO_IN) U9.40(GND) U9.42(GND) U9.43(GND)
NetAE1_1: AE1.1 C72.2 L5.1
NetC73_2: C73.2 L5.2 U9.41(ANT)
NetC75_1: C75.1 L6.1 U9.31(VIN_LDO)
NetL6_2: L6.2 U9.34(SR_VLX)
NetR14_1: U9.22(SDIO_CMD) ; port SDIO_WIFI.CMD
NetR15_1: U9.24(SDIO_DATA_0) ; port SDIO_WIFI.DATA0
NetR16_1: U9.26(SDIO_DATA_1) ; port SDIO_WIFI.DATA1
NetR17_1: U9.23(SDIO_DATA_2) ; port SDIO_WIFI.DATA2
NetR18_1: U9.25(SDIO_DATA_3) ; port SDIO_WIFI.DATA3
NetR19_2: U9.20(SDIO_CLK) ; port SDIO_WIFI.CLK

Not connected (* = marked no-connect by the designer): U9 2(NC) 3(NC) 4(NC) 5(NC) 6(NC) 7(NC) 8(NC) 9(NC) 10(NC) 11(NC) 13(NC) 15(WL_GPIO_4) 16(NC) 17(WL_GPIO_2) 18(WL_GPIO_1) 27(WL_GPIO_0_HOST_WAKE)* 28(WL_REG_ON)* 38(NC) 39(NC)

### Library data of the parts
AE1 = 2450AT42A100E: Manufacturer: Johanson Technology Inc.; PartNumber: 2450AT42A100E; Mounting Technology: Surface Mount
C72 C73 = CAP_1.5pF_50V_0402_0.05pF: 1.5pF 50V 0.05pF 0402 (1005 Metric); PartNumber: GRM1555C1H1R5WA01D; Manufacturer: Murata; Mounting Technology: Surface Mount; PackageReference: 0402; PackageDescription: 0402 (1005 Metric); Voltage: 50V; Tolerance: 0.05pF
C74 = CAP_2.2uF_6.3V_0402_20%: 2.2uF 6.3V 20% 0402 (1005 Metric); PartNumber: GRM155R60J225ME15D; Manufacturer: Murata; Mounting Technology: Surface Mount; PackageReference: 0402; PackageDescription: 0402 (1005 Metric); Voltage: 6.3V; Tolerance: 20%
C75 C76 = CAP_4.7uF_6.3V_0402_20%: as C53 on sheet MPU-Power; Mounting Technology: Surface Mount; PackageReference: 0402; PackageDescription: 0402 (1005 Metric); Voltage: 6.3V; Tolerance: 20%
L5 = IND_3.9nH_0.3A_0402_0.3nH: 3.9nH +/-0.3nH 0.3A 0402; PartNumber: LQG15HS3N9S02D; Manufacturer: Murata; PackageReference: 0402; PackageDescription: 0402 (2012 metric); Mounting Technology: Surface Mount; Current: 0.3A; Value: 3.9nH
L6 = IND_2.2uH_750mA_0603_20%: as L2 on sheet Supplies; PackageReference: 0603; PackageDescription: 0603 (1608 metric); Mounting Technology: Surface Mount; Current: 750mA; Value: 2.2uH
U9 = LBWA1KL1FX-875: WI-FI-B/G/N NETWORK CONTROLLER; Manufacturer: Murata; PartNumber: LBWA1KL1FX-875; PackageReference: Module; Mounting Technology: Surface Mount

## Sheet USB.SchDoc
size A
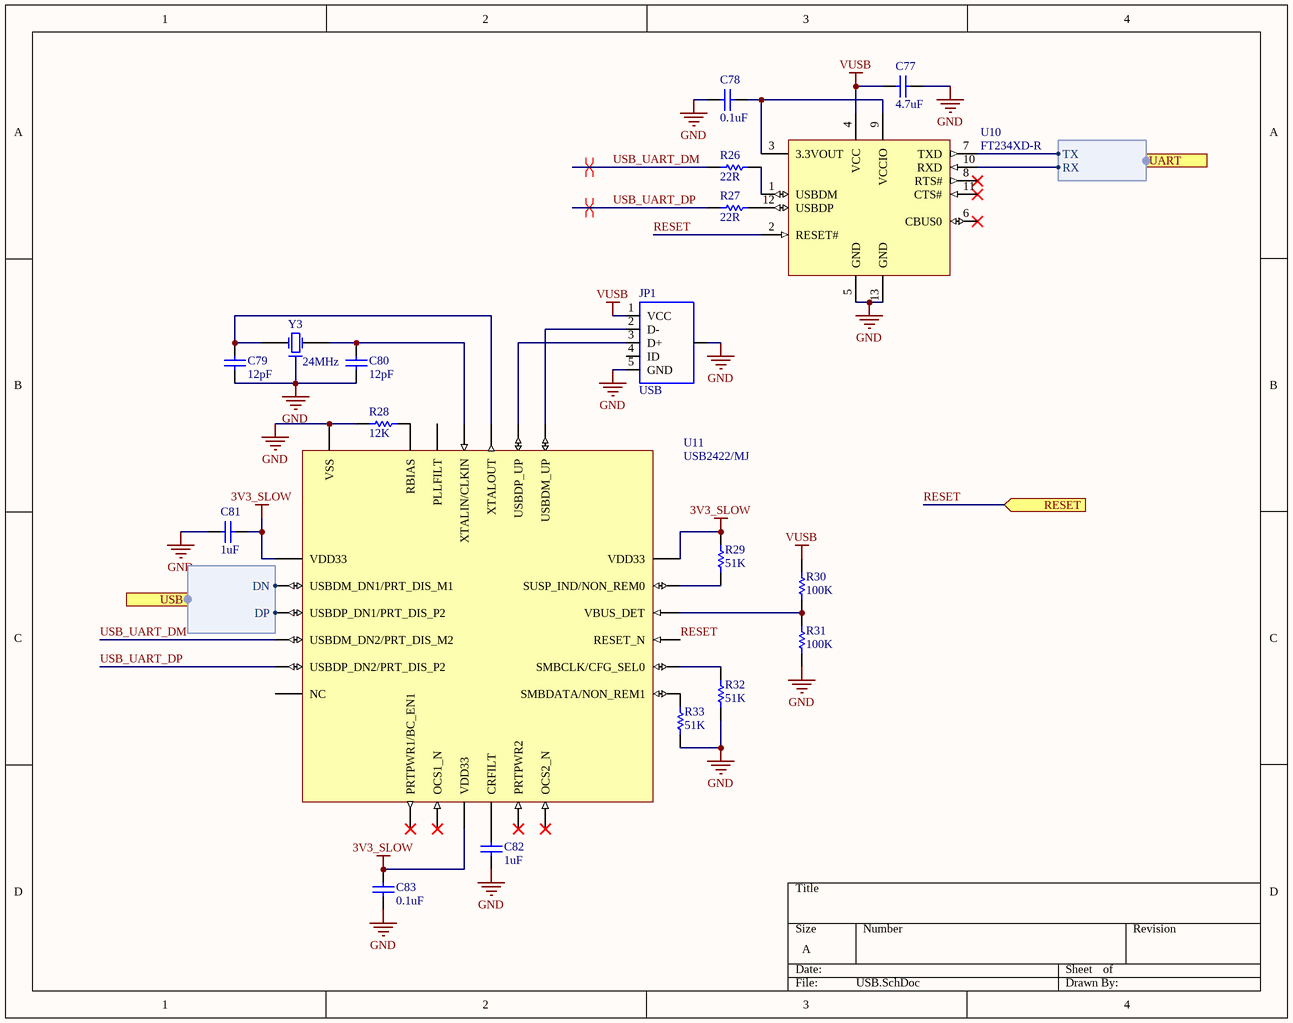
[diagram p6: USB.SchDoc]

### Parts
C77  value 4.7uF  [C0402[1005X55]]  (hidden comment: 4.7uF 6.3V 0402)
C78  value 0.1uF  [C0402[1005X55]]  (hidden comment: 0.1uF 6.3V 0402)
C79  value 12pF  [C0402[1005X55]]  (hidden comment: 12pF 50V 0402)
C80  value 12pF  [C0402[1005X55]]  (hidden comment: 12pF 50V 0402)
C81  value 1uF  [C0402[1005X55]]  (hidden comment: 1uF 6.3V 0402)
C82  value 1uF  [C0402[1005X55]]  (hidden comment: 1uF 6.3V 0402)
C83  value 0.1uF  [C0402[1005X55]]  (hidden comment: 0.1uF 6.3V 0402)
JP1  USB  [USB-MICROB]
R26  value 22R  [R0402[1005]]  (hidden comment: 22R 1% 0402)
R27  value 22R  [R0402[1005]]  (hidden comment: 22R 1% 0402)
R28  value 12K  [R0402[1005]]  (hidden comment: 12K 1% 0402)
R29  value 51K  [R0402[1005]]  (hidden comment: 51K 1% 0402)
R30  value 100K  [R0402[1005]]  (hidden comment: 100K 1% 0402)
R31  value 100K  [R0402[1005]]  (hidden comment: 100K 1% 0402)
R32  value 51K  [R0402[1005]]  (hidden comment: 51K 1% 0402)
R33  value 51K  [R0402[1005]]  (hidden comment: 51K 1% 0402)
U10  FT234XD-R  [DFN-12]
U11  USB2422/MJ  [QFN-24 (4x4MM)]
Y3  24MHz  [CRYSTAL_2.0x1.6]

### Ports
RESET (in), UART (harness UART), USB (harness USB)

### Harnesses
USB: DN, DP
UART: TX, RX

### Nets
3V3_SLOW: C81.2 C83.2 R29.2 U11.1(VDD33) U11.9(VDD33) U11.18(VDD33)
GND: C77.2 C78.2 C79.1 C80.1 C81.1 C82.1 C83.1 JP1.5(GND) JP1.6(SHIELD) R28.1 R31.1 R32.1 R33.1 U10.5(GND) U10.13(GND) U11.25(VSS) Y3.2
VUSB: C77.1 JP1.1(VCC) R30.2 U10.4(VCC)
RESET: U10.2(RESET#) U11.15(RESET_N) ; port RESET
UART_RX: U10.10(RXD) ; port UART.RX
UART_TX: U10.7(TXD) ; port UART.TX
USB_OTG_N: U11.2(USBDM_DN1/PRT_DIS_M1) ; port USB.DN
USB_OTG_P: U11.3(USBDP_DN1/PRT_DIS_P2) ; port USB.DP
USB_UART_DM: R26.1 U11.4(USBDM_DN2/PRT_DIS_M2)
USB_UART_DP: R27.1 U11.5(USBDP_DN2/PRT_DIS_P2)
NetC78_1: C78.1 U10.3(3.3VOUT) U10.9(VCCIO)
NetC79_2: C79.2 U11.21(XTALOUT) Y3.1(X1)
NetC80_2: C80.2 U11.22(XTALIN/CLKIN) Y3.3(X2)
NetC82_2: C82.2 U11.10(CRFILT)
NetJP1_2: JP1.2(D-) U11.19(USBDM_UP)
NetJP1_3: JP1.3(D+) U11.20(USBDP_UP)
NetR26_2: R26.2 U10.1(USBDM)
NetR27_2: R27.2 U10.12(USBDP)
NetR28_2: R28.2 U11.24(RBIAS)
NetR29_1: R29.1 U11.17(SUSP_IND/NON_REM0)
NetR30_1: R30.1 R31.2 U11.16(VBUS_DET)
NetR32_2: R32.2 U11.14(SMBCLK/CFG_SEL0)
NetR33_2: R33.2 U11.13(SMBDATA/NON_REM1)

Not connected (* = marked no-connect by the designer): JP1 4(ID); U10 6(CBUS0)* 8(RTS#)* 11(CTS#)*; U11 6(NC) 7(PRTPWR1/BC_EN1)* 8(OCS1_N)* 11(PRTPWR2)* 12(OCS2_N)* 23(PLLFILT)

### Layout directives
differential pair: USB_UART_DM, USB_UART_DP

### Library data of the parts
C77 = CAP_4.7uF_6.3V_0402_20%: as C53 on sheet MPU-Power; Mounting Technology: Surface Mount; PackageReference: 0402; PackageDescription: 0402 (1005 Metric); Voltage: 6.3V; Tolerance: 20%
C78 C83 = CAP_0.1uF_6.3V_0402_10%: as C68 on sheet Supplies; Mounting Technology: Surface Mount; PackageReference: 0402; PackageDescription: 0402 (1005 Metric); Voltage: 6.3V; Tolerance: 10%
C79 C80 = CAP_12pF_50V_0402_5%: as C1 on sheet MPU-Control; Mounting Technology: Surface Mount; PackageReference: 0402; PackageDescription: 0402 (1005 Metric); Voltage: 50V; Tolerance: 5%
C81 C82 = CAP_1uF_6.3V_0402_10%: 1uF 6.3V 10% 0402 (1005 Metric); PartNumber: GRM155R70J105KA12D; Manufacturer: Murata; Mounting Technology: Surface Mount; PackageReference: 0402; PackageDescription: 0402 (1005 Metric); Voltage: 6.3V; Tolerance: 10%
JP1 = USB_MICROB_SMT: pin to pad: 1>VBUS 2>D- 3>D+ 4>ID 5>GND 6>MT1+P$1+P$2+MT2; PartNumber: 10118192-0001LF; Manufacturer: Amphenol FCI; Mounting Technology: Surface Mount; PackageReference: USB - Micro B
R26 R27 = RES_22R_0402_1%: 22R 0.063W 1% 0402 (1005 Metric); Manufacturer: KOA Speer; PartNumber: RK73H1ETTP22R0F; Tolerance: 1%; Power: 0.063W; Mounting Technology: Surface Mount; PackageReference: 0402; PackageDescription: 0402 (1005 Metric); ComponentLink1Description: Datasheet; ComponentLink1URL: http://www.koaspeer.com/catimages/Products/RK73H/RK73H.pdf
R28 = RES_12K_0402_1%: 12K 0.063W 1% 0402 (1005 Metric); Manufacturer: KOA Speer; PartNumber: RK73H1ETTP1202F; Tolerance: 1%; Power: 0.063W; Mounting Technology: Surface Mount; PackageReference: 0402; PackageDescription: 0402 (1005 Metric); ComponentLink1Description: Datasheet; ComponentLink1URL: http://www.koaspeer.com/catimages/Products/RK73H/RK73H.pdf
R29 R32 R33 = RES_51K_0402_1%: 51K 0.063W 1% 0402 (1005 Metric); Manufacturer: KOA Speer; PartNumber: RK73H1ETTP5102F; Tolerance: 1%; Power: 0.063W; Mounting Technology: Surface Mount; PackageReference: 0402; PackageDescription: 0402 (1005 Metric); ComponentLink1Description: Datasheet; ComponentLink1URL: http://www.koaspeer.com/catimages/Products/RK73H/RK73H.pdf
R30 R31 = RES_100K_0402_1%: as R14 on sheet MPU-Peripherals; Tolerance: 1%; Power: 0.063W; Mounting Technology: Surface Mount; PackageReference: 0402; PackageDescription: 0402 (1005 Metric); ComponentLink1Description: Datasheet; ComponentLink1URL: http://www.koaspeer.com/catimages/Products/RK73H/RK73H.pdf
U10 = FT234XD-R: USB Interface IC USB to Serial UART Interface; Manufacturer: FTDI; PartNumber: FT234XD-R; PackageReference: DFN-12; Mounting Technology: Surface Mount
U11 = USB2422/MJ: USB Hub IC 2-Port; Manufacturer: Microchip; PartNumber: USB2422/MJ; PackageReference: QFN-24; Mounting Technology: Surface Mount
Y3 = FA-128 24.0000MF10Z-W3: Manufacturer: EPSON; PartNumber: FA-128 24.0000MF10Z-W3; Mounting Technology: Surface Mount; PackageReference: 4-SMD

## Sheet Sensors.SchDoc
size A
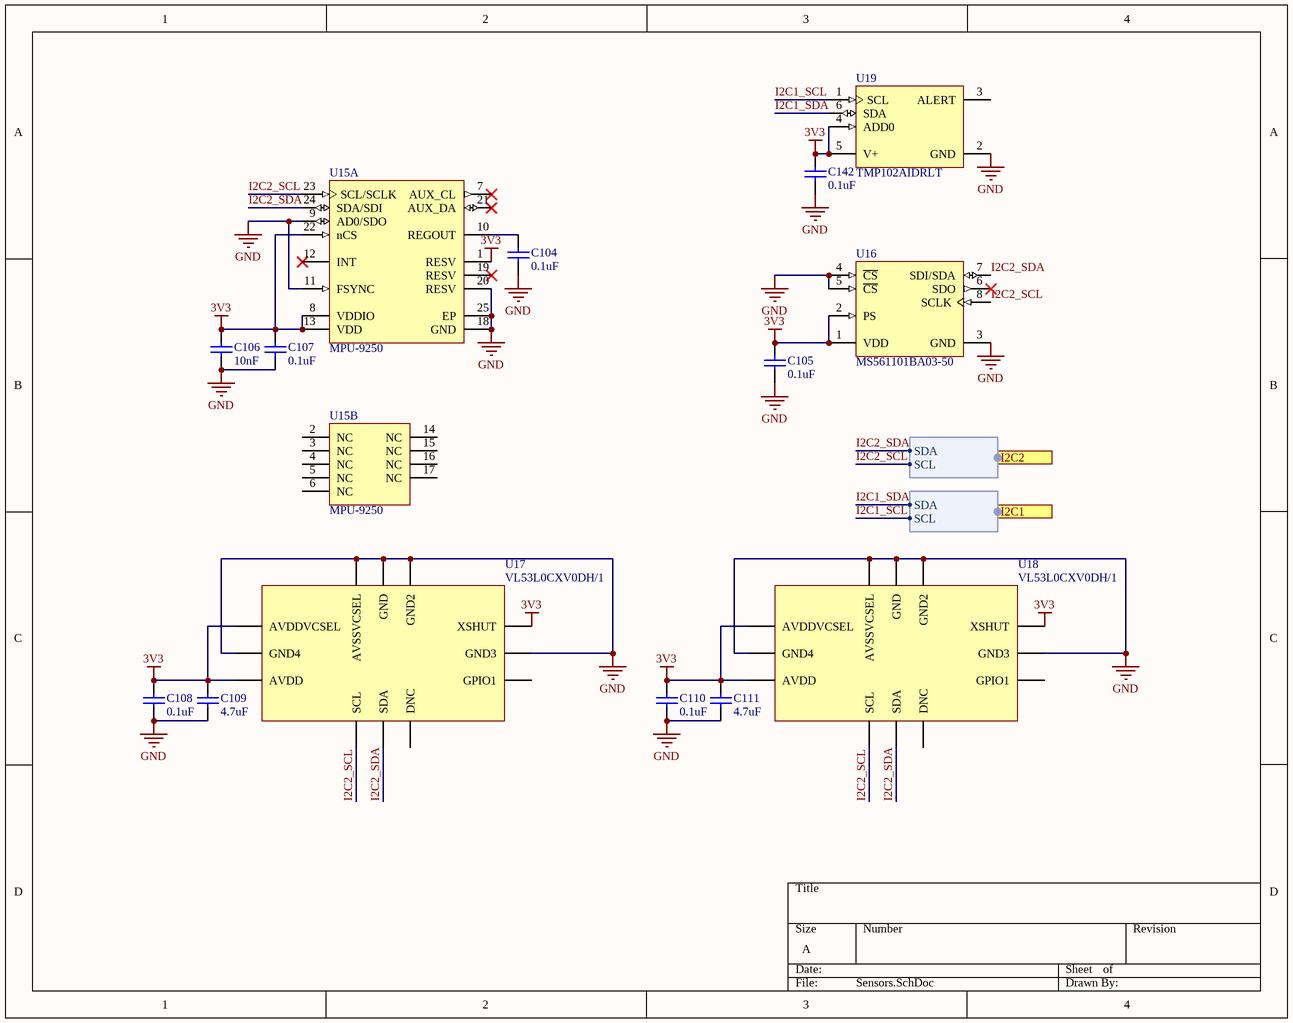
[diagram p7: Sensors.SchDoc]

### Parts
C104  value 0.1uF  [C0402[1005X55]]  (hidden comment: 0.1uF 6.3V 0402)
C105  value 0.1uF  [C0402[1005X55]]  (hidden comment: 0.1uF 6.3V 0402)
C106  value 10nF  [C0402[1005X55]]  (hidden comment: 10nF 50V 0402)
C107  value 0.1uF  [C0402[1005X55]]  (hidden comment: 0.1uF 6.3V 0402)
C108  value 0.1uF  [C0402[1005X55]]  (hidden comment: 0.1uF 6.3V 0402)
C109  value 4.7uF  [C0402[1005X55]]  (hidden comment: 4.7uF 6.3V 0402)
C110  value 0.1uF  [C0402[1005X55]]  (hidden comment: 0.1uF 6.3V 0402)
C111  value 4.7uF  [C0402[1005X55]]  (hidden comment: 4.7uF 6.3V 0402)
C142  value 0.1uF  [C0402[1005X55]]  (hidden comment: 0.1uF 6.3V 0402)
U15  MPU-9250  [QFN-24 (0.4MM)]  (parts A,B of 2)
U16  MS561101BA03-50  [MSI-MS561101BA03-50-8_V]
U17  VL53L0CXV0DH/1  [LGA-12]
U18  VL53L0CXV0DH/1  [LGA-12]
U19  TMP102AIDRLT  [DRL0006A_L]

### Ports
I2C1 (harness I2C), I2C2 (harness I2C)

### Harnesses
I2C: SCL, SDA

### Nets
3V3: C105.2 C106.2 C107.2 C108.2 C109.2 C110.2 C111.2 C142.2 U15.1(RESV) U15.8(VDDIO) U15.13(VDD) U15.22(nCS) U16.1(VDD) U16.2(PS) U17.1(AVDDVCSEL) U17.5(XSHUT) U17.11(AVDD) U18.1(AVDDVCSEL) U18.5(XSHUT) U18.11(AVDD) U19.4(ADD0) U19.5(V+)
GND: C104.1 C105.1 C106.1 C107.1 C108.1 C109.1 C110.1 C111.1 C142.1 U15.9(AD0/SDO) U15.11(FSYNC) U15.18(GND) U15.20(RESV) U15.25(EP) U16.3(GND) U16.4(~{CS}) U16.5(~{CS}) U17.2(AVSSVCSEL) U17.3(GND) U17.4(GND2) U17.6(GND3) U17.12(GND4) U18.2(AVSSVCSEL) U18.3(GND) U18.4(GND2) U18.6(GND3) U18.12(GND4) U19.2(GND)
I2C1_SCL: U19.1(SCL) ; port I2C1.SCL
I2C1_SDA: U19.6(SDA) ; port I2C1.SDA
I2C2_SCL: U15.23(SCL/SCLK) U16.8(SCLK) U17.10(SCL) U18.10(SCL) ; port I2C2.SCL
I2C2_SDA: U15.24(SDA/SDI) U16.7(SDI/SDA) U17.9(SDA) U18.9(SDA) ; port I2C2.SDA
NetC104_2: C104.2 U15.10(REGOUT)

Not connected (* = marked no-connect by the designer): U15 2(NC) 3(NC) 4(NC) 5(NC) 6(NC) 7(AUX_CL)* 12(INT)* 14(NC) 15(NC) 16(NC) 17(NC) 19(RESV)* 21(AUX_DA)*; U16 6(SDO)*; U17 7(GPIO1) 8(DNC); U18 7(GPIO1) 8(DNC); U19 3(ALERT)

### Library data of the parts
C104 C105 C107 C108 C110 C142 = CAP_0.1uF_6.3V_0402_10%: as C68 on sheet Supplies; Mounting Technology: Surface Mount; PackageReference: 0402; PackageDescription: 0402 (1005 Metric); Voltage: 6.3V; Tolerance: 10%
C106 = CAP_10nF_50V_0402_10%: 10nF 50V 10% 0402 (1005 Metric); PartNumber: GCM155R71H103KA55D; Manufacturer: Murata; Mounting Technology: Surface Mount; PackageReference: 0402; PackageDescription: 0402 (1005 Metric); Voltage: 50V; Tolerance: 10%
C109 C111 = CAP_4.7uF_6.3V_0402_20%: as C53 on sheet MPU-Power; Mounting Technology: Surface Mount; PackageReference: 0402; PackageDescription: 0402 (1005 Metric); Voltage: 6.3V; Tolerance: 20%
U15 = MPU-9250: Manufacturer: Invensense; PartNumber: MPU-9250; Mounting Technology: Surface Mount; PackageReference: QFN-24
U16 = CMP-2000-05251-1: Barometric Pressure Sensor, with Stainless Steel Cap, 1.8 to 3.6 V, -45 to 85 degC, 8-Pin QFN, RoHS, Tape and Reel; Manufacturer: Measurement Specialties; Operating Pressure Max: 1200mbar; Supply Current: 12.5µA; Supply Voltage Max: 3.6V; Supply Voltage Min: 1.8V; No. of Pins: 8; Connection Size: 0.5mm; SVHC: NoSVHC(20-Jun-2013); Operating Pressure Min: 10mbar; Manufacturer URL: http://www.meas-spec.com/; Operating Temperature Min: -40degC; Pressure Type: Barometric; Package Reference: MS561101BA03-50-8; Datasheet URL: http://www.te.com/commerce/DocumentDelivery/DDEController?Action=srchrtrv&DocNm=MS5611-01BA03&DocType=Data+Sheet&DocLang=English&DocFormat=pdf&PartCntxt=CAT-BLPS0036; Package Description: 8-Pin Surface Mount Device, Body 5 x 3 mm, Pitch 1.25 mm; Sensor Case Style: QFN; Datasheet Version: Sep-15; Operating Temperature Max: 85degC
U17 U18 = VL53L0CXV0DH/1: Optical Sensor Modules Time-of-Flight (ToF) ranging sensor; Manufacturer: STMicroelectronics; PartNumber: VL53L0CXV0DH/1; Mounting Technology: Surface Mount; PackageReference: LGA-12
U19 = CMP-1685-00013-1: Low Power Digital Temperature Sensor with SMBus and Two-Wire Serial Interface, 1.4 to 3.6 V, -40 to 125 degC, 6-Pin SOT (DRL), Green (RoHS & no Sb/Br), Tape and Reel; ComponentLink3URL: http://www.ti.com/lit/ml/mpds159c/mpds159c.pdf; PackageVersion: 4205622-3/D, 08/2207; ComponentLink2Description: Datasheet; PackageReference: DRL0006A; ComponentLink2URL: http://www.ti.com/lit/ds/symlink/tmp102.pdf; ComponentLink3Description: Package Specification; ComponentLink1Description: Manufacturer URL; DatasheetVersion: SBOS397F, 12/2015; PackageDescription: 6-Pin Plastic Small Outline, Body 1.6 x 1.2 mm, Pitch 0.5 mm; ComponentLink1URL: http://www.ti.com/